# EAGLE design LED_wchip (EAGLE 9.2.0)
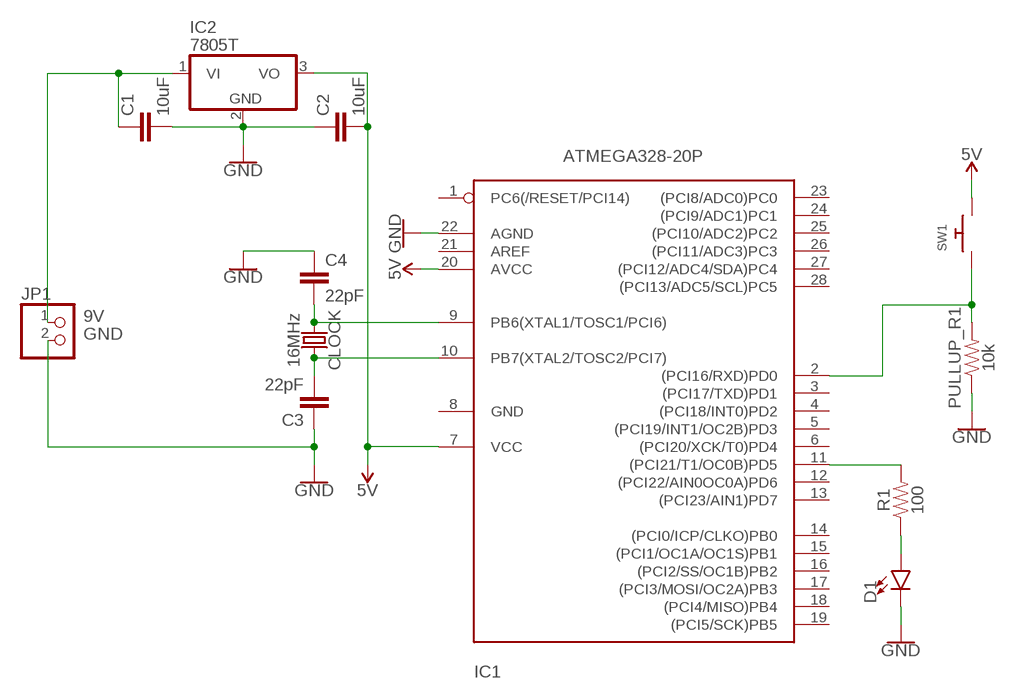
[diagram p0: schematic, sheet 1]

## Parts
C1  10uF  10UF-1210-50V-20%  [1210]
C2  10uF  10UF-1210-50V-20%  [1210]
C3  22pF  22PF-0603-50V-5%  [0603]
C4  22pF  22PF-0603-50V-5%  [0603]
CLOCK  16MHz  CRYSTAL-16MHZPTH-HC49US  [HC49US]
D1  LED5MM  [LED_5MM]
IC1  ATMEGA328-20P  [DIL28-3]
IC2  7805T  [TO220H]
JP1  PINHD-1X2  [1X02]
PULLUP_R1  10k  10KOHM-HORIZ-1/4W-1%  [AXIAL-0.3]
R1  100  100OHM-HORIZ-1/4W-1%  [AXIAL-0.3]
SW1  SWITCH_PUSHBUTTONEVQ-PE  [TACT_PANA-EVQ]

## Nets
5V: C2.2 IC1.7(VCC) IC1.20(AVCC) IC2.3(VO) SW1.P$2
9V: C1.1 IC2.1(VI) JP1.1
GND: C1.2 C2.1 C3.1 C4.1 D1.K(C) IC1.22(AGND) IC2.2(GND) JP1.2 PULLUP_R1.P$1
N$2: IC1.2((PCI16/RXD)PD0) PULLUP_R1.P$2 SW1.P$1
N$3: IC1.11((PCI21/T1/OC0B)PD5) R1.P$2
N$4: C4.2 CLOCK.1 IC1.9(PB6(XTAL1/TOSC1/PCI6))
N$5: C3.2 CLOCK.2 IC1.10(PB7(XTAL2/TOSC2/PCI7))
N$6: D1.A R1.P$1
Unconnected: IC1.1(PC6(/RESET/PCI14)) IC1.3((PCI17/TXD)PD1) IC1.4((PCI18/INT0)PD2) IC1.5((PCI19/INT1/OC2B)PD3) IC1.6((PCI20/XCK/T0)PD4) IC1.8(GND) IC1.12((PCI22/AIN0OC0A)PD6) IC1.13((PCI23/AIN1)PD7) IC1.14((PCI0/ICP/CLKO)PB0) IC1.15((PCI1/OC1A/OC1S)PB1) IC1.16((PCI2/SS/OC1B)PB2) IC1.17((PCI3/MOSI/OC2A)PB3) IC1.18((PCI4/MISO)PB4) IC1.19((PCI5/SCK)PB5) IC1.21(AREF) IC1.23((PCI8/ADC0)PC0) IC1.24((PCI9/ADC1)PC1) IC1.25((PCI10/ADC2)PC2) IC1.26((PCI11/ADC3)PC3) IC1.27((PCI12/ADC4/SDA)PC4) IC1.28((PCI13/ADC5/SCL)PC5)

## Library data of the parts
C1 C2 = SparkFun-Capacitors:10UF: 10.0µF ceramic capacitors A capacitor is a passive two-terminal electrical component used to store electrical energy temporarily in an electric field.; PROD_ID: CAP-09824
C3 C4 = SparkFun-Capacitors:22PF: 22pF ceramic capacitors A capacitor is a passive two-terminal electrical component used to store electrical energy temporarily in an electric field.; PROD_ID: CAP-07876
CLOCK = SparkFun-Clocks:CRYSTAL-16MHZ: 16MHz Crystal Digikey Example <http://www.digikey.com/product-search/en?keywords=535-9122-1-ND> Frequency: 16MHz Frequency Stability: ±50ppm Frequency Tolerance: ±20ppm Load Capacitance: 18pF SparkFun Products: Pro Micro -5V/16MHz <https://www.sparkfun.com/products/12640> SparkFun Serial Enabled LCD Kit <https://www.sparkfun.com/products/10097>; PROD_ID: XTAL-08181; SF_ID: COM-00536
D1 = SparkFun-LED:LED: LED (Generic) Standard schematic elements and footprints for 5mm, 3mm, 1206, and 0603 sized LEDs. Generic LEDs with no color specified.
IC1 = atmega328:ATMEGA328*P: MICROCONTROLLER 32 kBytes FLASH 2 kBytes SRAM 1 kBytes EEPROM USART 8-channel 10 bit ADC
IC2 = adafruit:78*: Positive VOLTAGE REGULATOR Added bigger pads to the TO-92 package
JP1 = DC_LOAD_AU:PINHD-1X2: PIN HEADER
PULLUP_R1 = SparkFun-Resistors:10KOHM: 10kΩ resistor A resistor is a passive two-terminal electrical component that implements electrical resistance as a circuit element. Resistors act to reduce current flow, and, at the same time, act to lower voltage levels within circuits. - Wikipedia; PROD_ID: RES-12183
R1 = SparkFun-Resistors:100OHM: 100Ω resistor A resistor is a passive two-terminal electrical component that implements electrical resistance as a circuit element. Resistors act to reduce current flow, and, at the same time, act to lower voltage levels within circuits. - Wikipedia; PROD_ID: RES-12181
SW1 = adafruit:SWITCH_PUSHBUTTON: Buttons SOFTTOUCHSMD_SJ - Soft touch temporary push button (Super Junk Akihabara) Compatible with SKPMANE010 [Mouser: 688-SKPMAN] C&K_KSS = Digikey: KSS221GLFS

## Net classes
0 default: width 0.508 mm, drill 0.508 mm, clearance 0.305 mm

## Board
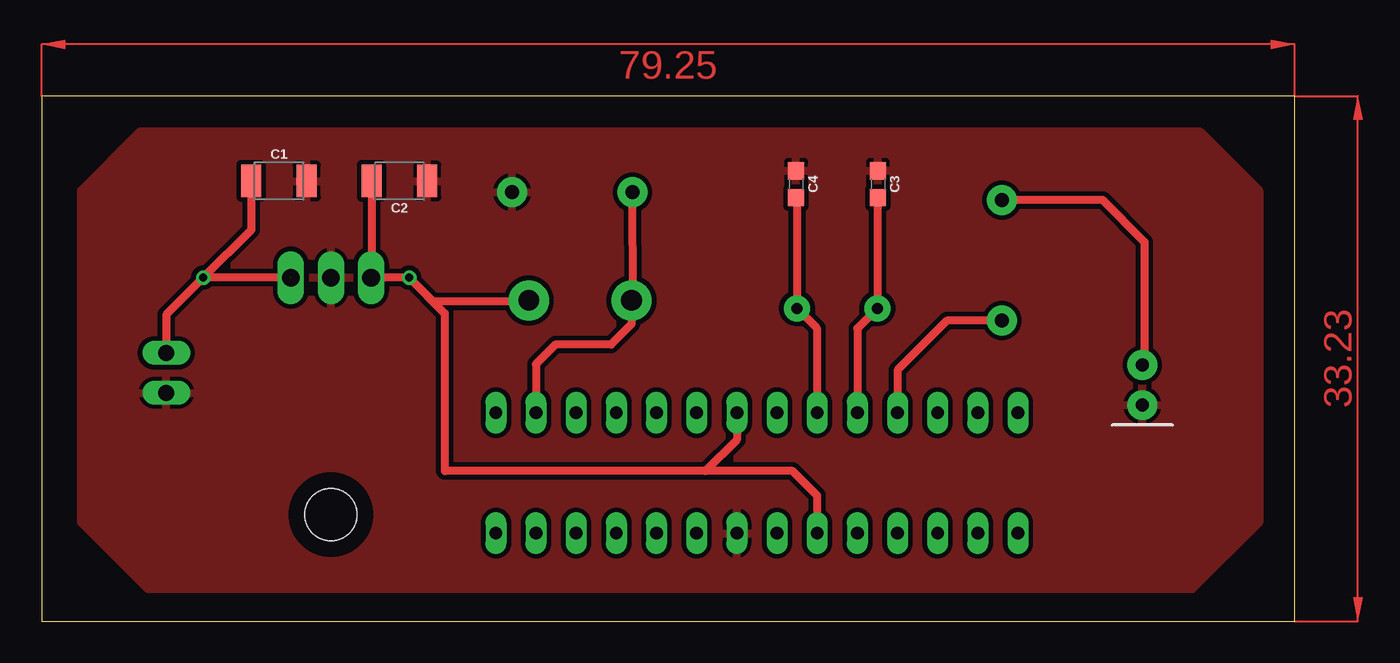
[diagram p1: board, top side]
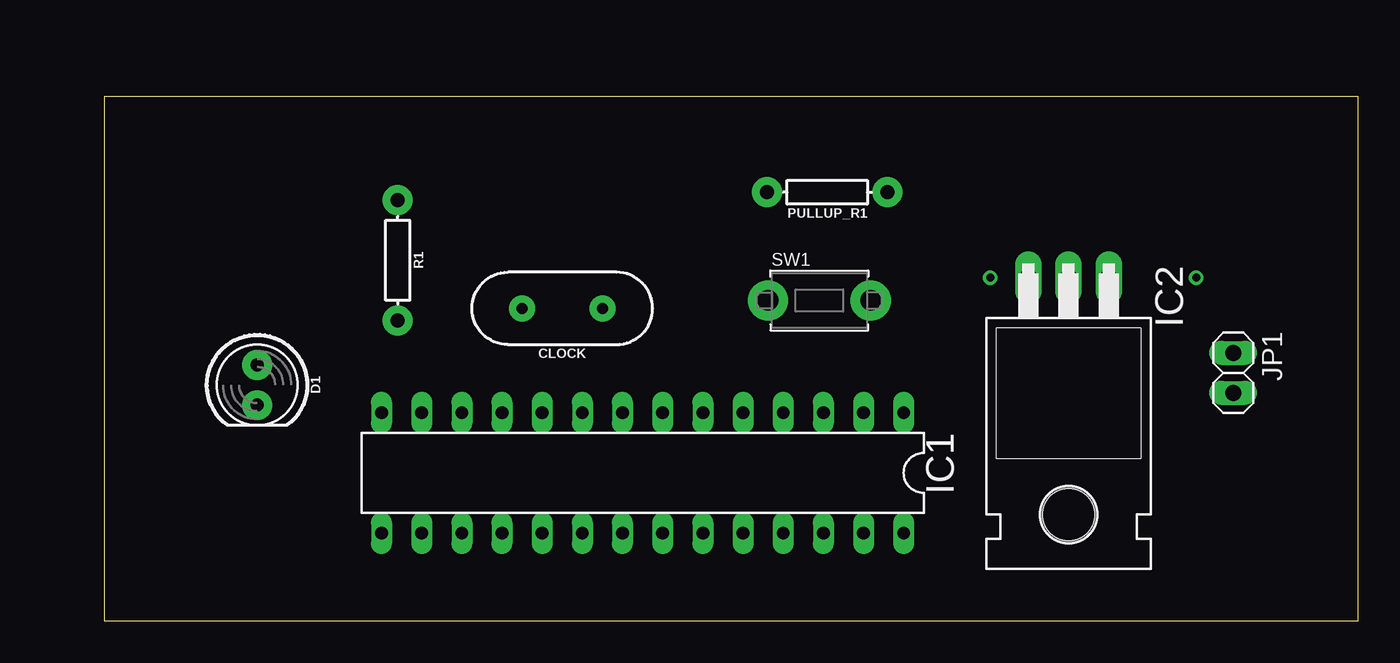
[diagram p2: board, bottom side, seen from below]

Size 79.25 x 33.23 mm. Coordinates in mm from the lower left corner, seen from the top.
Outline: 0,0 79.25,0 79.25,33.23 0,33.23 0,0
Copper layers (1*16): Top 0.035mm / dielectric 1.5mm / Bottom 0.035mm
Design rules "default": minimum track width 6mil, minimum drill 0.35mm, track to track 6mil, track to pad 6mil, pad to pad 6mil, via to via 6mil, smd to smd 6mil, copper to edge 40mil, drill to drill 6mil, minimum pad ring 10mil, minimum via ring 8mil, stop-mask expansion 4mil, vias tented up to drill 0mil, thermal gap 10mil

### Footprints (pad centres in the part's own frame; a part is rotated, then mirrored left to right if it is on the bottom)
1210 = smd 1.27 x 2.06: 1 -1.755,0; 2 1.755,0
0603 = smd 1.1 x 1: 1 -0.85,0; 2 0.85,0
HC49US = drill 0.7 pad 1.651: 1 -2.54,0; 2 2.54,0
LED_5MM = drill 0.813 pad 1.88: A -1.27,0; K 1.27,0
DIL28-3 = drill 0.813 long: 1 -16.51,-3.81; 2 -13.97,-3.81; 3 -11.43,-3.81; 4 -8.89,-3.81; 5 -6.35,-3.81; 6 -3.81,-3.81; 7 -1.27,-3.81; 8 1.27,-3.81; 9 3.81,-3.81; 10 6.35,-3.81; 11 8.89,-3.81; 12 11.43,-3.81; 13 13.97,-3.81; 14 16.51,-3.81; 15 16.51,3.81; 16 13.97,3.81; 17 11.43,3.81; 18 8.89,3.81; 19 6.35,3.81; 20 3.81,3.81; 21 1.27,3.81; 22 -1.27,3.81; 23 -3.81,3.81; 24 -6.35,3.81; 25 -8.89,3.81; 26 -11.43,3.81; 27 -13.97,3.81; 28 -16.51,3.81
TO220H = drill 1.118 long: 1 -2.54,-10.16; 2 0,-10.16; 3 2.54,-10.16 | hole 3.302: 0,4.826
1X02 = drill 1.016 long: 1 -1.27,0; 2 1.27,0
AXIAL-0.3 = drill 0.9 pad 1.88: P$1 -3.81,0; P$2 3.81,0
TACT_PANA-EVQ = drill 1.3 pad 2.54: P$1 -3.25,0; P$2 3.25,0

### Placement (x,y rotation side)
C1  15.01,27.85 0 top
C2  22.63,27.85 180 top
C3  52.89,27.65 270 top
C4  47.72,27.65 270 top
CLOCK  50.32,19.79 180 bottom
D1  69.62,14.94 270 bottom
IC1  45.24,9.38 180 bottom
IC2  18.3,11.57 180 bottom
JP1  7.89,15.71 270 bottom
PULLUP_R1  33.56,27.14 180 bottom
R1  60.73,22.83 270 bottom
SW1  34.06,20.29 0 bottom

### Tracks (layer width: path | path; a pad name or v marks a point on that pad's centre or on a via)
5V  (via drill 0.51)
  Top 0.508: C2.2 20.88,21.85 v20.84,21.82 IC2.3 v23.25,21.73 | v23.25,21.73 24.75,20.23 v30.87,20.23 SW1.P$2 | v23.25,21.73 25.5,19.48 25.5,9.5 42,9.5 | 42,9.5 47.5,9.5 49.05,7.95 v49.05,5.45 IC1.20 | v43.97,13.28 IC1.7 43.97,11.47 42,9.5
9V  (via drill 0.51)  (1 unrouted)
  Top 0.508: JP1.1 v7.89,16.89 7.89,19.39 v10.23,21.73 | C1.1 13.26,24.75 v10.23,21.73 | IC2.1 v10.23,21.73
  other vias: 15.77,21.75
GND  (via drill 0.51)
  Top 0.508: JP1.2 7.89,14.47 v8,14.58 8,14.5 | IC2.2 v18.19,21.62 | D1.K v69.62,13.63 69.75,13.5 | v44,5.54 IC1.22 | v29.75,27.25 PULLUP_R1.P$1
  pour Top: 6.25,31 73.25,31 77,27.25 77,6.25 72.75,2 6.75,2 2.5,6.25 2.5,27.25
N$2  (via drill 0.51)
  Top 0.508: IC1.2 v31.27,13.27 31.27,16.27 32.5,17.5 36.02,17.5 37.31,18.79 SW1.P$1 v37.4,20.37 v37.41,20.38 PULLUP_R1.P$2
  other vias: 37.37,27.14
N$3  (via drill 0.51)
  Top 0.508: IC1.11 v54.13,13.13 54.13,15.88 57.27,19.02 v60.77,19.02 R1.P$2
N$4  (via drill 0.51)
  Top 0.508: IC1.9 v49.05,13.27 49.03,13.29 49.03,18.54 CLOCK.1 47.78,26.74 C4.2
  other vias: 47.78,19.79
N$5  (via drill 0.51)
  Top 0.508: IC1.10 v51.59,13.27 51.59,18.52 CLOCK.2 52.86,26.77 C3.2
  other vias: 52.86,19.79
N$6  (via drill 0.51)
  Top 0.508: R1.P$1 v60.61,26.64 67.11,26.64 69.75,24 v69.75,16.34 D1.A
(copper drawn outside any net)
  shapes: Top area x2